# Altium schematic sheet Page2.SchDoc
size 420 x 297 mm
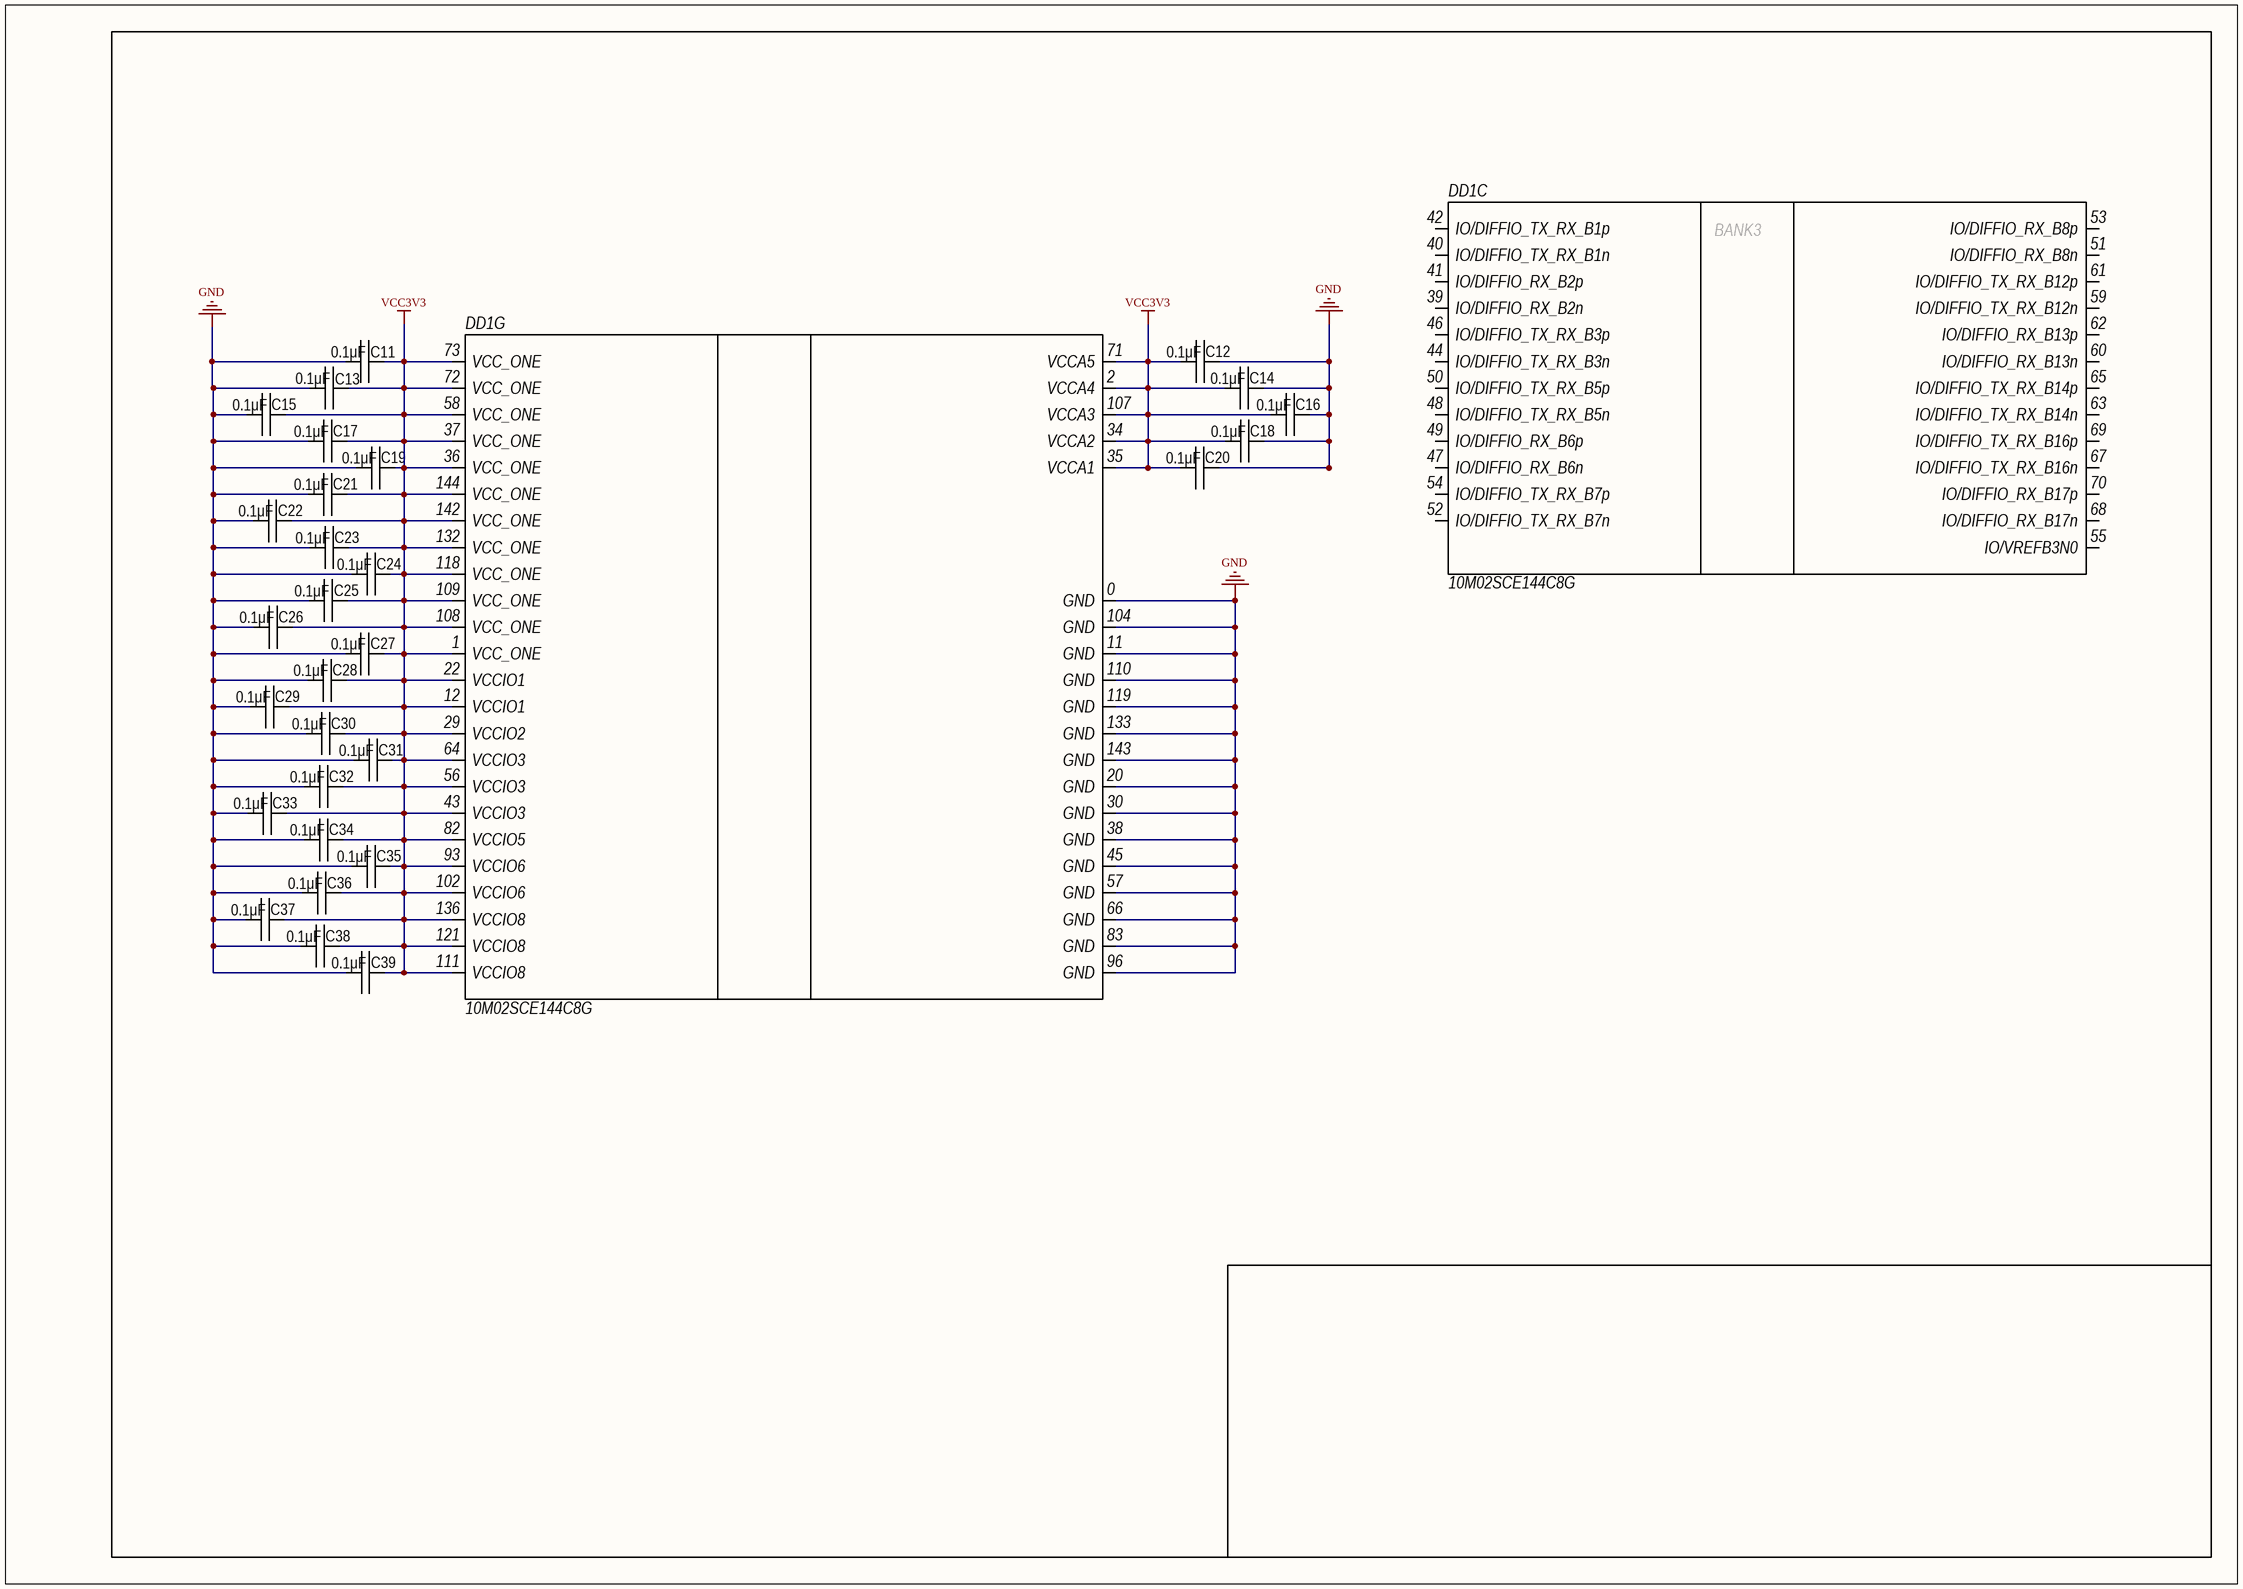
[diagram p0: Page2.SchDoc]

## Parts
C11  value 0.1μF  [CAP: 0805]
C12  value 0.1μF  [CAP: 0805]
C13  value 0.1μF  [CAP: 0805]
C14  value 0.1μF  [CAP: 0805]
C15  value 0.1μF  [CAP: 0805]
C16  value 0.1μF  [CAP: 0805]
C17  value 0.1μF  [CAP: 0805]
C18  value 0.1μF  [CAP: 0805]
C19  value 0.1μF  [CAP: 0805]
C20  value 0.1μF  [CAP: 0805]
C21  value 0.1μF  [CAP: 0805]
C22  value 0.1μF  [CAP: 0805]
C23  value 0.1μF  [CAP: 0805]
C24  value 0.1μF  [CAP: 0805]
C25  value 0.1μF  [CAP: 0805]
C26  value 0.1μF  [CAP: 0805]
C27  value 0.1μF  [CAP: 0805]
C28  value 0.1μF  [CAP: 0805]
C29  value 0.1μF  [CAP: 0805]
C30  value 0.1μF  [CAP: 0805]
C31  value 0.1μF  [CAP: 0805]
C32  value 0.1μF  [CAP: 0805]
C33  value 0.1μF  [CAP: 0805]
C34  value 0.1μF  [CAP: 0805]
C35  value 0.1μF  [CAP: 0805]
C36  value 0.1μF  [CAP: 0805]
C37  value 0.1μF  [CAP: 0805]
C38  value 0.1μF  [CAP: 0805]
C39  value 0.1μF  [CAP: 0805]
DD1  10M02SCE144C8G  [144-Lead EQFP]  (parts C,G of 7)

## Nets
GND: C11.2 C12.1 C13.2 C14.1 C15.2 C16.1 C17.2 C18.1 C19.2 C20.1 C21.2 C22.2 C23.2 C24.2 C25.2 C26.2 C27.2 C28.2 C29.2 C30.2 C31.2 C32.2 C33.2 C34.2 C35.2 C36.2 C37.2 C38.2 C39.2 DD1.0(GND) DD1.11(GND) DD1.20(GND) DD1.30(GND) DD1.38(GND) DD1.45(GND) DD1.57(GND) DD1.66(GND) DD1.83(GND) DD1.96(GND) DD1.104(GND) DD1.110(GND) DD1.119(GND) DD1.133(GND) DD1.143(GND)
VCC3V3: C11.1 C12.2 C13.1 C14.2 C15.1 C16.2 C17.1 C18.2 C19.1 C20.2 C21.1 C22.1 C23.1 C24.1 C25.1 C26.1 C27.1 C28.1 C29.1 C30.1 C31.1 C32.1 C33.1 C34.1 C35.1 C36.1 C37.1 C38.1 C39.1 DD1.1(VCC_ONE) DD1.2(VCCA4) DD1.12(VCCIO1) DD1.22(VCCIO1) DD1.29(VCCIO2) DD1.34(VCCA2) DD1.35(VCCA1) DD1.36(VCC_ONE) DD1.37(VCC_ONE) DD1.43(VCCIO3) DD1.56(VCCIO3) DD1.58(VCC_ONE) DD1.64(VCCIO3) DD1.71(VCCA5) DD1.72(VCC_ONE) DD1.73(VCC_ONE) DD1.82(VCCIO5) DD1.93(VCCIO6) DD1.102(VCCIO6) DD1.107(VCCA3) DD1.108(VCC_ONE) DD1.109(VCC_ONE) DD1.111(VCCIO8) DD1.118(VCC_ONE) DD1.121(VCCIO8) DD1.132(VCC_ONE) DD1.136(VCCIO8) DD1.142(VCC_ONE) DD1.144(VCC_ONE)

Not connected (* = marked no-connect by the designer): DD1 39(IO/DIFFIO_RX_B2n) 40(IO/DIFFIO_TX_RX_B1n) 41(IO/DIFFIO_RX_B2p) 42(IO/DIFFIO_TX_RX_B1p) 44(IO/DIFFIO_TX_RX_B3n) 46(IO/DIFFIO_TX_RX_B3p) 47(IO/DIFFIO_RX_B6n) 48(IO/DIFFIO_TX_RX_B5n) 49(IO/DIFFIO_RX_B6p) 50(IO/DIFFIO_TX_RX_B5p) 51(IO/DIFFIO_RX_B8n) 52(IO/DIFFIO_TX_RX_B7n) 53(IO/DIFFIO_RX_B8p) 54(IO/DIFFIO_TX_RX_B7p) 55(IO/VREFB3N0) 59(IO/DIFFIO_TX_RX_B12n) 60(IO/DIFFIO_RX_B13n) 61(IO/DIFFIO_TX_RX_B12p) 62(IO/DIFFIO_RX_B13p) 63(IO/DIFFIO_TX_RX_B14n) 65(IO/DIFFIO_TX_RX_B14p) 67(IO/DIFFIO_TX_RX_B16n) 68(IO/DIFFIO_RX_B17n) 69(IO/DIFFIO_TX_RX_B16p) 70(IO/DIFFIO_RX_B17p)

## Notes on the sheet
- (in symbol 10M02SCE144C8G, part C) BANK3

## Library data of the parts
C11-C39 = Ceramic_0805: ValueManufacturerPartNumber: Ceramic capacitor, 0.1μF, X7R, , , 0805,; TypeCapacitor: Ceramic capacitor; TypeDielectric: X7R; Package: 0805
DD1 = 10M02SCE144C8G: MAX10 FPGA; Manufacturer: Intel; Value: 10M02SCE144C8G; HelpUrl: https://www.digikey.com/product-detail/en/intel/10M02SCE144C8G/544-3098-ND/5284822; PartNumber: 10M02SCE144C8G